# Altium schematic sheet ChargeControl2019.SchDoc
size A3
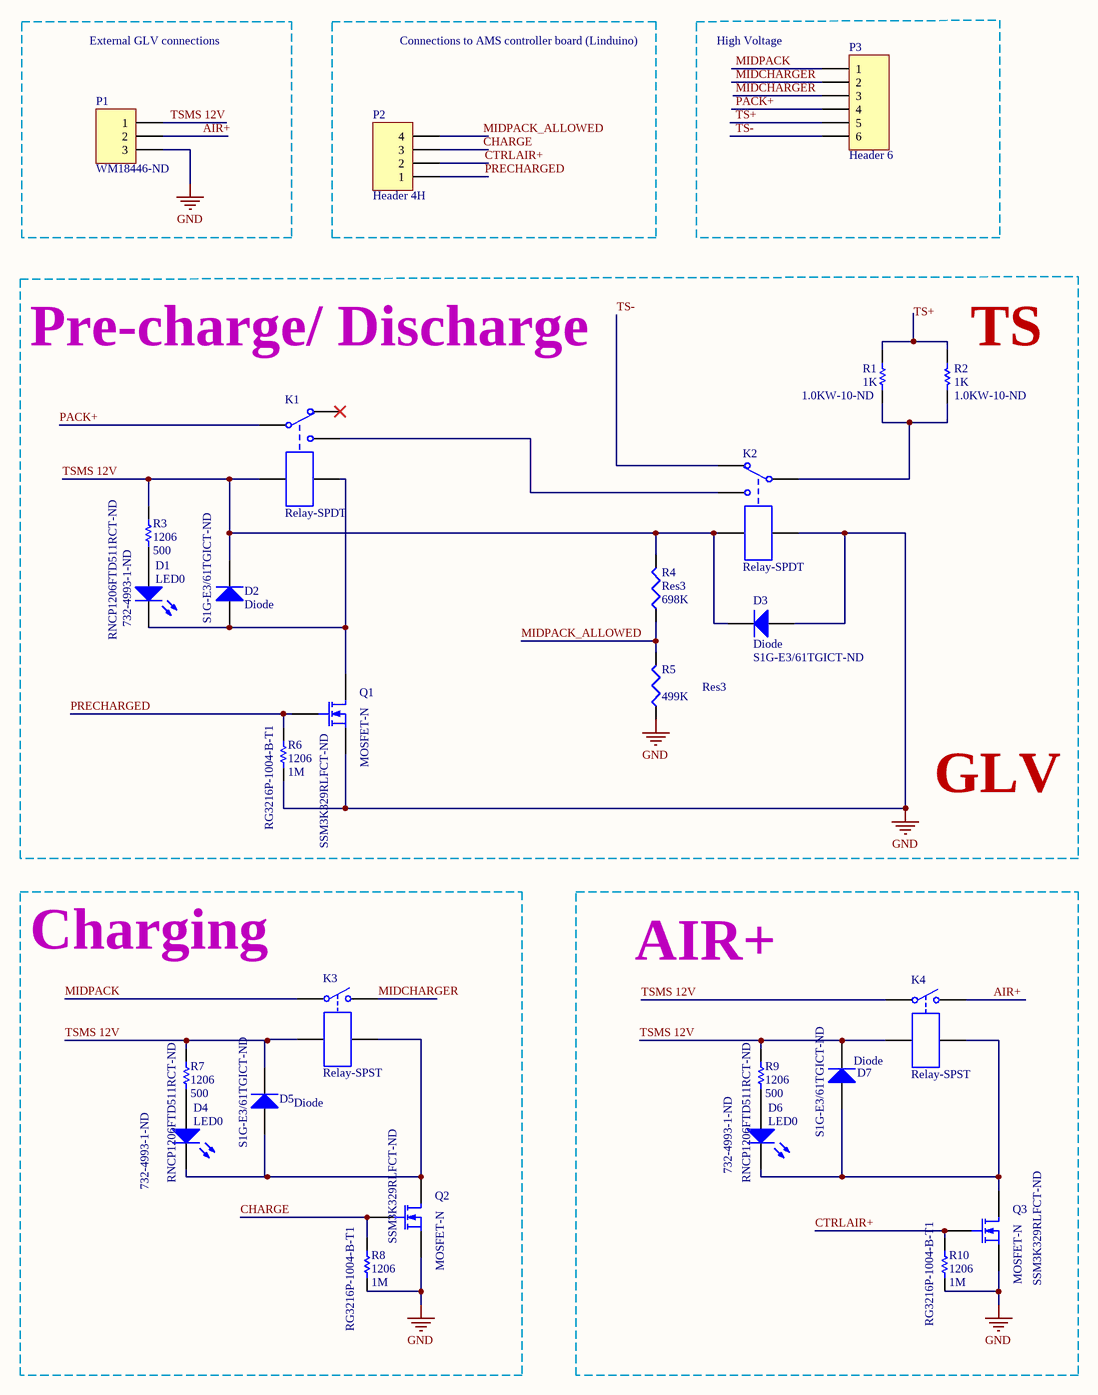
[diagram p0: ChargeControl2019.SchDoc]

## Parts
D1  LED0  Supplier Part Number: 732-4993-1-ND  [LEDC3216X120NGRN]
D2  Diode  Supplier Part Number: S1G-E3/61TGICT-ND  [VISH-DO-214AC-SMA-2_N]
D3  Diode  Supplier Part Number: S1G-E3/61TGICT-ND  [VISH-DO-214AC-SMA-2_N]
D4  LED0  Supplier Part Number: 732-4993-1-ND  [LEDC3216X120NGRN]
D5  Diode  Supplier Part Number: S1G-E3/61TGICT-ND  [VISH-DO-214AC-SMA-2_N]
D6  LED0  Supplier Part Number: 732-4993-1-ND  [LEDC3216X120NGRN]
D7  Diode  Supplier Part Number: S1G-E3/61TGICT-ND  [VISH-DO-214AC-SMA-2_N]
K1  Relay-SPDT  [G2RL14]
K2  Relay-SPDT  [G2RL14]
K3  Relay-SPST  [G2RL1ADC12]
K4  Relay-SPST  [G2RL1ADC12]
P1  Supplier Part Number: WM18446-ND  [Conn3pin]  (hidden comment: Header 3)
P2  Header 4H  [Conn4pin]
P3  Header 6  [Conn6pin]
Q1  MOSFET-N  Supplier Part Number: SSM3K329RLFCT-ND  [SOT23-3]
Q2  MOSFET-N  Supplier Part Number: SSM3K329RLFCT-ND  [SOT23-3]
Q3  MOSFET-N  Supplier Part Number: SSM3K329RLFCT-ND  [SOT23-3]
R1  value 1K  Supplier Part Number: 1.0KW-10-ND  [YAG_SQP10]  (hidden comment: Res1)
R2  value 1K  Supplier Part Number: 1.0KW-10-ND  [YAG_SQP10]  (hidden comment: Res1)
R3  1206  value 500  Supplier Part Number: RNCP1206FTD511RCT-ND  [RESC3216X60N]
R4  Res3  value 698K  [RESC3216X60N]
R5  Res3  value 499K  [RESC3216X60N]
R6  1206  value 1M  Supplier Part Number: RG3216P-1004-B-T1  [RESC3216X60N]
R7  1206  value 500  Supplier Part Number: RNCP1206FTD511RCT-ND  [RESC3216X60N]
R8  1206  value 1M  Supplier Part Number: RG3216P-1004-B-T1  [RESC3216X60N]
R9  1206  value 500  Supplier Part Number: RNCP1206FTD511RCT-ND  [RESC3216X60N]
R10  1206  value 1M  Supplier Part Number: RG3216P-1004-B-T1  [RESC3216X60N]

## Blocks framed on the sheet
External GLV connections: P1
Connections to AMS controller board (Linduino): P2
High Voltage: P3
Charging: D4 D5 K3 Q2 R7 R8
AIR+: D6 D7 K4 Q3 R9 R10

## Nets
GND: D3.1(A) K2.1 P1.3 Q1.3(S) Q2.3(S) Q3.3(S) R5.1 R6.1 R8.1 R10.1
AIR+: K4.3 P1.2
CHARGE: P2.3 Q2.2(G) R8.2
CTRLAIR+: P2.2 Q3.2(G) R10.2
MIDCHARGER: K3.3 P3.2 P3.3
MIDPACK: K3.4 P3.1
MIDPACK_ALLOWED: P2.4 R4.1 R5.2
PACK+: K1.4 P3.4
PRECHARGED: P2.1 Q1.2(G) R6.2
TS+: P3.5 R1.2 R2.2
TS-: K2.2 P3.6
TSMS 12V: D2.2(K) D3.2(K) D5.2(K) D7.2(K) K1.1 K2.5 K3.1 K4.1 K4.4 P1.1 R3.1 R4.2 R7.1 R9.1
NetD1_1: D1.1(A) R3.2
NetD1_2: D1.2(K) D2.1(A) K1.5 Q1.1(D)
NetD4_1: D4.1(A) R7.2
NetD4_2: D4.2(K) D5.1(A) K3.5 Q2.1(D)
NetD6_1: D6.1(A) R9.2
NetD6_2: D6.2(K) D7.1(A) K4.5 Q3.1(D)
NetK1_3: K1.3 K2.3
NetK2_4: K2.4 R1.1 R2.1

Not connected (* = marked no-connect by the designer): K1 2*

## Notes on the sheet
- (near K1) Pre-charge/ Discharge
- (near R2) TS
- GLV
- Document name:
- Date:
- Time:
- Project name:
- Drawn by:
- Validation
- Sheet
- University of Victoria
- 3800 Finnerty Road
- Victoria BC V8P 5C2
- of
- Revision:
- CANADA
- Size:
- A3

## Library data of the parts
D1 D4 D6 = LED0: Typical INFRARED GaAs LED; Published: 8-Jun-2000; LatestRevisionDate: 08-Jul-2005; LatestRevisionNote: Mech Layer 1 removed.; PackageReference: LED-0; Publisher: Altium Limited; PackageDescription: LED; 2 Leads; Supplier 1: Digi-Key
D2 D3 D5 D7 = Diode: Switching diode; Published: 8-Jun-2000; LatestRevisionDate: 17-Jul-2002; LatestRevisionNote: Re-released for DXP Platform.; PackageVersion: Sep-1996; PackageReference: SMC; Publisher: Altium Limited; PackageDescription: DO-214-AB/SMC; 2 C-Bend Leads; Body 7.9 x 5.9 mm, inc. leads (LxW); Code_JEDEC: DO-214-AB; Supplier 1: Digi-Key
K1 K2 = Relay-SPDT: Single-Pole Dual-Throw Relay; Published: 24-Mar-1999; LatestRevisionDate: 17-Jul-2002; LatestRevisionNote: Re-released for DXP Platform.; PackageReference: MODULE5B; Publisher: Altium Limited; Supplier Part Number: Z3076-ND
  K2: Supplier: Digikey
K3 K4 = Relay-SPST: Single-Pole Single-Throw Relay; Published: 24-Mar-1999; LatestRevisionDate: 17-Jul-2002; LatestRevisionNote: Re-released for DXP Platform.; PackageReference: MODULE4; Publisher: Altium Limited; Supplier Part Number: Z3080-ND
P1 = Header 3: 3 pos wire to board; LatestRevisionDate: 17-Jul-2002; LatestRevisionNote: Re-released for DXP Platform.; Publisher: Altium Limited; Supplier Part Number 2: WM18434-ND
P2 = Header 4H: Header, 4-Pin, Right Angle; LatestRevisionDate: 17-Jul-2002; LatestRevisionNote: Re-released for DXP Platform.; Publisher: Altium Limited; Supplier Part Number 2: WM3701-ND; Supplier Part Number: WM21352-ND
P3 = Header 6: Header, 6-Pin; LatestRevisionDate: 17-Jul-2002; LatestRevisionNote: Re-released for DXP Platform.; Publisher: Altium Limited
Q1-Q3 = MOSFET-N: N-Channel MOSFET; Published: 8-Jun-2000; LatestRevisionDate: 17-Jul-2002; LatestRevisionNote: Re-released for DXP Platform.; PackageVersion: 1995/1996; PackageReference: E3; Publisher: Altium Limited; PackageDescription: TO, Flat Index; 3 In-Line, Axial Leads; Body Dia. 4.6mm; Lead Dia. 0.5 mm (max); Supplier 1: Digi-Key
R1-R3 R6-R10 = Res1: Resistor; Published: 8-Jun-2000; LatestRevisionDate: 17-Jul-2002; LatestRevisionNote: Re-released for DXP Platform.; PackageReference: AXIAL-0.3; Publisher: Altium Limited; PackageDescription: Axial Device, Thru-Hole; 2 Leads; 0.3 in Pin Spacing
  R3 R6-R10: Supplier 1: Digi-Key
R4 R5 = Res3: Resistor; Published: 8-Jun-2000; LatestRevisionDate: 29-May-2009; LatestRevisionNote: IPC-7351 Footprint Added.; PackageReference: J1-0603; Publisher: Altium Limited; PackageDescription: Chip Resistor
  R4: Supplier Part Number: 541-698KFCT-ND
  R5: Supplier Part Number: 541-499KFCT-ND